# Altium schematic sheet LEDS.SchDoc
size A
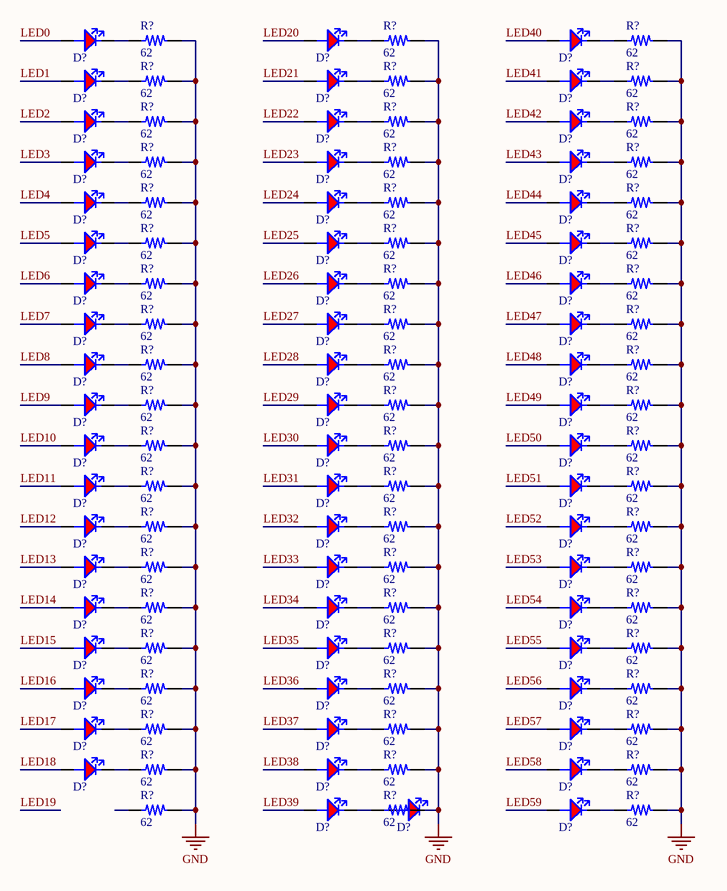
[diagram p0: LEDS.SchDoc]

## Parts
(Parts that share a designator on the sheet are numbered #1, #2 ... from top to bottom, then left to right.)
D?#1  LED0402_RED  [LED0402]  (value not drawn)
D?#2  LED0402_RED  [LED0402]  (value not drawn)
D?#3  LED0402_RED  [LED0402]  (value not drawn)
D?#4  LED0402_RED  [LED0402]  (value not drawn)
D?#5  LED0402_RED  [LED0402]  (value not drawn)
D?#6  LED0402_RED  [LED0402]  (value not drawn)
D?#7  LED0402_RED  [LED0402]  (value not drawn)
D?#8  LED0402_RED  [LED0402]  (value not drawn)
D?#9  LED0402_RED  [LED0402]  (value not drawn)
D?#10  LED0402_RED  [LED0402]  (value not drawn)
D?#11  LED0402_RED  [LED0402]  (value not drawn)
D?#12  LED0402_RED  [LED0402]  (value not drawn)
D?#13  LED0402_RED  [LED0402]  (value not drawn)
D?#14  LED0402_RED  [LED0402]  (value not drawn)
D?#15  LED0402_RED  [LED0402]  (value not drawn)
D?#16  LED0402_RED  [LED0402]  (value not drawn)
D?#17  LED0402_RED  [LED0402]  (value not drawn)
D?#18  LED0402_RED  [LED0402]  (value not drawn)
D?#19  LED0402_RED  [LED0402]  (value not drawn)
D?#20  LED0402_RED  [LED0402]  (value not drawn)
D?#21  LED0402_RED  [LED0402]  (value not drawn)
D?#22  LED0402_RED  [LED0402]  (value not drawn)
D?#23  LED0402_RED  [LED0402]  (value not drawn)
D?#24  LED0402_RED  [LED0402]  (value not drawn)
D?#25  LED0402_RED  [LED0402]  (value not drawn)
D?#26  LED0402_RED  [LED0402]  (value not drawn)
D?#27  LED0402_RED  [LED0402]  (value not drawn)
D?#28  LED0402_RED  [LED0402]  (value not drawn)
D?#29  LED0402_RED  [LED0402]  (value not drawn)
D?#30  LED0402_RED  [LED0402]  (value not drawn)
D?#31  LED0402_RED  [LED0402]  (value not drawn)
D?#32  LED0402_RED  [LED0402]  (value not drawn)
D?#33  LED0402_RED  [LED0402]  (value not drawn)
D?#34  LED0402_RED  [LED0402]  (value not drawn)
D?#35  LED0402_RED  [LED0402]  (value not drawn)
D?#36  LED0402_RED  [LED0402]  (value not drawn)
D?#37  LED0402_RED  [LED0402]  (value not drawn)
D?#38  LED0402_RED  [LED0402]  (value not drawn)
D?#39  LED0402_RED  [LED0402]  (value not drawn)
D?#40  LED0402_RED  [LED0402]  (value not drawn)
D?#41  LED0402_RED  [LED0402]  (value not drawn)
D?#42  LED0402_RED  [LED0402]  (value not drawn)
D?#43  LED0402_RED  [LED0402]  (value not drawn)
D?#44  LED0402_RED  [LED0402]  (value not drawn)
D?#45  LED0402_RED  [LED0402]  (value not drawn)
D?#46  LED0402_RED  [LED0402]  (value not drawn)
D?#47  LED0402_RED  [LED0402]  (value not drawn)
D?#48  LED0402_RED  [LED0402]  (value not drawn)
D?#49  LED0402_RED  [LED0402]  (value not drawn)
D?#50  LED0402_RED  [LED0402]  (value not drawn)
D?#51  LED0402_RED  [LED0402]  (value not drawn)
D?#52  LED0402_RED  [LED0402]  (value not drawn)
D?#53  LED0402_RED  [LED0402]  (value not drawn)
D?#54  LED0402_RED  [LED0402]  (value not drawn)
D?#55  LED0402_RED  [LED0402]  (value not drawn)
D?#56  LED0402_RED  [LED0402]  (value not drawn)
D?#57  LED0402_RED  [LED0402]  (value not drawn)
D?#58  LED0402_RED  [LED0402]  (value not drawn)
D?#59  LED0402_RED  [LED0402]  (value not drawn)
D?#60  LED0402_RED  [LED0402]  (value not drawn)
R?#1  62  [RES0402]
R?#2  62  [RES0402]
R?#3  62  [RES0402]
R?#4  62  [RES0402]
R?#5  62  [RES0402]
R?#6  62  [RES0402]
R?#7  62  [RES0402]
R?#8  62  [RES0402]
R?#9  62  [RES0402]
R?#10  62  [RES0402]
R?#11  62  [RES0402]
R?#12  62  [RES0402]
R?#13  62  [RES0402]
R?#14  62  [RES0402]
R?#15  62  [RES0402]
R?#16  62  [RES0402]
R?#17  62  [RES0402]
R?#18  62  [RES0402]
R?#19  62  [RES0402]
R?#20  62  [RES0402]
R?#21  62  [RES0402]
R?#22  62  [RES0402]
R?#23  62  [RES0402]
R?#24  62  [RES0402]
R?#25  62  [RES0402]
R?#26  62  [RES0402]
R?#27  62  [RES0402]
R?#28  62  [RES0402]
R?#29  62  [RES0402]
R?#30  62  [RES0402]
R?#31  62  [RES0402]
R?#32  62  [RES0402]
R?#33  62  [RES0402]
R?#34  62  [RES0402]
R?#35  62  [RES0402]
R?#36  62  [RES0402]
R?#37  62  [RES0402]
R?#38  62  [RES0402]
R?#39  62  [RES0402]
R?#40  62  [RES0402]
R?#41  62  [RES0402]
R?#42  62  [RES0402]
R?#43  62  [RES0402]
R?#44  62  [RES0402]
R?#45  62  [RES0402]
R?#46  62  [RES0402]
R?#47  62  [RES0402]
R?#48  62  [RES0402]
R?#49  62  [RES0402]
R?#50  62  [RES0402]
R?#51  62  [RES0402]
R?#52  62  [RES0402]
R?#53  62  [RES0402]
R?#54  62  [RES0402]
R?#55  62  [RES0402]
R?#56  62  [RES0402]
R?#57  62  [RES0402]
R?#58  62  [RES0402]
R?#59  62  [RES0402]
R?#60  62  [RES0402]

## Nets
GND: D?#59.2(K) R?#1.2 R?#2.2 R?#3.2 R?#4.2 R?#5.2 R?#6.2 R?#7.2 R?#8.2 R?#9.2 R?#10.2 R?#11.2 R?#12.2 R?#13.2 R?#14.2 R?#15.2 R?#16.2 R?#17.2 R?#18.2 R?#19.2 R?#20.2 R?#21.2 R?#22.2 R?#23.2 R?#24.2 R?#25.2 R?#26.2 R?#27.2 R?#28.2 R?#29.2 R?#30.2 R?#31.2 R?#32.2 R?#33.2 R?#34.2 R?#35.2 R?#36.2 R?#37.2 R?#38.2 R?#39.2 R?#40.2 R?#41.2 R?#42.2 R?#43.2 R?#44.2 R?#45.2 R?#46.2 R?#47.2 R?#48.2 R?#49.2 R?#50.2 R?#51.2 R?#52.2 R?#53.2 R?#54.2 R?#55.2 R?#56.2 R?#57.2 R?#58.2 R?#59.2 R?#60.2
LED0: D?#1.1(A)
LED1: D?#4.1(A)
LED2: D?#7.1(A)
LED3: D?#10.1(A)
LED4: D?#13.1(A)
LED5: D?#16.1(A)
LED6: D?#19.1(A)
LED7: D?#22.1(A)
LED8: D?#25.1(A)
LED9: D?#28.1(A)
LED10: D?#31.1(A)
LED11: D?#34.1(A)
LED12: D?#37.1(A)
LED13: D?#40.1(A)
LED14: D?#43.1(A)
LED15: D?#46.1(A)
LED16: D?#49.1(A)
LED17: D?#52.1(A)
LED18: D?#55.1(A)
LED20: D?#2.1(A)
LED21: D?#5.1(A)
LED22: D?#8.1(A)
LED23: D?#11.1(A)
LED24: D?#14.1(A)
LED25: D?#17.1(A)
LED26: D?#20.1(A)
LED27: D?#23.1(A)
LED28: D?#26.1(A)
LED29: D?#29.1(A)
LED30: D?#32.1(A)
LED31: D?#35.1(A)
LED32: D?#38.1(A)
LED33: D?#41.1(A)
LED34: D?#44.1(A)
LED35: D?#47.1(A)
LED36: D?#50.1(A)
LED37: D?#53.1(A)
LED38: D?#56.1(A)
LED39: D?#58.1(A)
LED40: D?#3.1(A)
LED41: D?#6.1(A)
LED42: D?#9.1(A)
LED43: D?#12.1(A)
LED44: D?#15.1(A)
LED45: D?#18.1(A)
LED46: D?#21.1(A)
LED47: D?#24.1(A)
LED48: D?#27.1(A)
LED49: D?#30.1(A)
LED50: D?#33.1(A)
LED51: D?#36.1(A)
LED52: D?#39.1(A)
LED53: D?#42.1(A)
LED54: D?#45.1(A)
LED55: D?#48.1(A)
LED56: D?#51.1(A)
LED57: D?#54.1(A)
LED58: D?#57.1(A)
LED59: D?#60.1(A)
NetD?#1_2: D?#1.2(K) R?#1.1
NetD?#2_2: D?#2.2(K) R?#2.1
NetD?#3_2: D?#3.2(K) R?#3.1
NetD?#4_2: D?#4.2(K) R?#4.1
NetD?#5_2: D?#5.2(K) R?#5.1
NetD?#6_2: D?#6.2(K) R?#6.1
NetD?#7_2: D?#7.2(K) R?#7.1
NetD?#8_2: D?#8.2(K) R?#8.1
NetD?#9_2: D?#9.2(K) R?#9.1
NetD?#10_2: D?#10.2(K) R?#10.1
NetD?#11_2: D?#11.2(K) R?#11.1
NetD?#12_2: D?#12.2(K) R?#12.1
NetD?#13_2: D?#13.2(K) R?#13.1
NetD?#14_2: D?#14.2(K) R?#14.1
NetD?#15_2: D?#15.2(K) R?#15.1
NetD?#16_2: D?#16.2(K) R?#16.1
NetD?#17_2: D?#17.2(K) R?#17.1
NetD?#18_2: D?#18.2(K) R?#18.1
NetD?#19_2: D?#19.2(K) R?#19.1
NetD?#20_2: D?#20.2(K) R?#20.1
NetD?#21_2: D?#21.2(K) R?#21.1
NetD?#22_2: D?#22.2(K) R?#22.1
NetD?#23_2: D?#23.2(K) R?#23.1
NetD?#24_2: D?#24.2(K) R?#24.1
NetD?#25_2: D?#25.2(K) R?#25.1
NetD?#26_2: D?#26.2(K) R?#26.1
NetD?#27_2: D?#27.2(K) R?#27.1
NetD?#28_2: D?#28.2(K) R?#28.1
NetD?#29_2: D?#29.2(K) R?#29.1
NetD?#30_2: D?#30.2(K) R?#30.1
NetD?#31_2: D?#31.2(K) R?#31.1
NetD?#32_2: D?#32.2(K) R?#32.1
NetD?#33_2: D?#33.2(K) R?#33.1
NetD?#34_2: D?#34.2(K) R?#34.1
NetD?#35_2: D?#35.2(K) R?#35.1
NetD?#36_2: D?#36.2(K) R?#36.1
NetD?#37_2: D?#37.2(K) R?#37.1
NetD?#38_2: D?#38.2(K) R?#38.1
NetD?#39_2: D?#39.2(K) R?#39.1
NetD?#40_2: D?#40.2(K) R?#40.1
NetD?#41_2: D?#41.2(K) R?#41.1
NetD?#42_2: D?#42.2(K) R?#42.1
NetD?#43_2: D?#43.2(K) R?#43.1
NetD?#44_2: D?#44.2(K) R?#44.1
NetD?#45_2: D?#45.2(K) R?#45.1
NetD?#46_2: D?#46.2(K) R?#46.1
NetD?#47_2: D?#47.2(K) R?#47.1
NetD?#48_2: D?#48.2(K) R?#48.1
NetD?#49_2: D?#49.2(K) R?#49.1
NetD?#50_2: D?#50.2(K) R?#50.1
NetD?#51_2: D?#51.2(K) R?#51.1
NetD?#52_2: D?#52.2(K) R?#52.1
NetD?#53_2: D?#53.2(K) R?#53.1
NetD?#54_2: D?#54.2(K) R?#54.1
NetD?#55_2: D?#55.2(K) R?#55.1
NetD?#56_2: D?#56.2(K) R?#56.1
NetD?#57_2: D?#57.2(K) R?#57.1
NetD?#58_2: D?#58.2(K) R?#59.1
NetD?#60_2: D?#60.2(K) R?#60.1

Not connected (* = marked no-connect by the designer): D?#59 1(A); R?#58 1

## Library data of the parts
D?#1-D?#60 = LED0402_RED: Led red; Manufacturer: Everlight; Manufacturer Part Number: EAST1005BA0; Color: Blue; Lens Color: Colorless; Lens Transparency: Clear; Luminous Intensity: 50mcd; Test Current: 5mA; Viewing Angle: 120°; Dominant Wavelength: 471nm; Forward Voltage: 3.3V; Number of LEDs: 1; Forward Current: 30mA; Power Rating: 75mW; Wavelength: 631nm; Lens Style: Rectangular,Square; RoHS: Yes; Mount: Surface Mount; Case/Package: 0402; Packaging: Tape and Reel; Length: 1mm; Height: 0.45mm; Width: 0.5mm; Supplier 1: Digi-Key; Stock 1: 50832; Number of Pins: 2; Case Code (Imperial): 0402; Case Code (Metric): 1005; Min Operating Temperature: -30°C; Max Operating Temperature: 85°C; Package Quantity: 1; Illumination Color: Red; Radiation Hardening: No; Lead Free: Lead Free; REACH SVHC: Unknown; ComponentLink3URL: https://datasheet.ciiva.com/13945/vlmo1500-13945367.pdf?src-supplier=Digi-Key; ComponentLink3Description: https://datasheet.ciiva.com/13945/vlmo1500-13945367.pdf?src-supplier=Digi-Key; Supplier Part Number 1: VLMS1500-GS08DKR-ND; Pricing 1: 1 = 0.48000, 10 = 0.34600, 100 = 0.15360, 500 = 0.10752, 1000 = 0.08832 (USD)
R?#1-R?#60 = R0402_62: RES SMD 62 OHM 1% 1/16W 0402; Manufacturer: Yageo; Manufacturer Part Number: RC0402FR-0762RL; Resistance: 62R; Temperature Coefficient: 100ppm/°C; Voltage Rating (DC): 50V; Power Rating: 63mW; Supplier 1: Digi-Key; Stock 1: 193361; RoHS: Yes; Case/Package: 0402; Case Code (Imperial): 0402; Case Code (Metric): 1005; Min Operating Temperature: -55°C; Max Operating Temperature: 155°C; Packaging: Tape and Reel; Tolerance: 1%; Composition: Thick Film; Voltage Rating: 50V; Termination: SMD/SMT; Military Standard: Not; Length: 1mm; Height: 0.35mm; Width: 0.5mm; Depth: 0.5mm; REACH SVHC: Unknown; Lead Free: Lead Free; ComponentLink1URL: https://datasheet.ciiva.com/17086/pyu-rc0402-51-rohs-l-6-r-17086553.pdf?src-supplier=Future+Electronics; ComponentLink1Description: https://datasheet.ciiva.com/17086/pyu-rc0402-51-rohs-l-6-r-17086553.pdf?src-supplier=Future+Electronics; Supplier Part Number 1: 311-62.0LRDKR-ND; Pricing 1: 1 = 0.10000, 10 = 0.01600, 100 = 0.00640, 1000 = 0.00289, 2500 = 0.00251, 5000 = 0.00207 (USD)